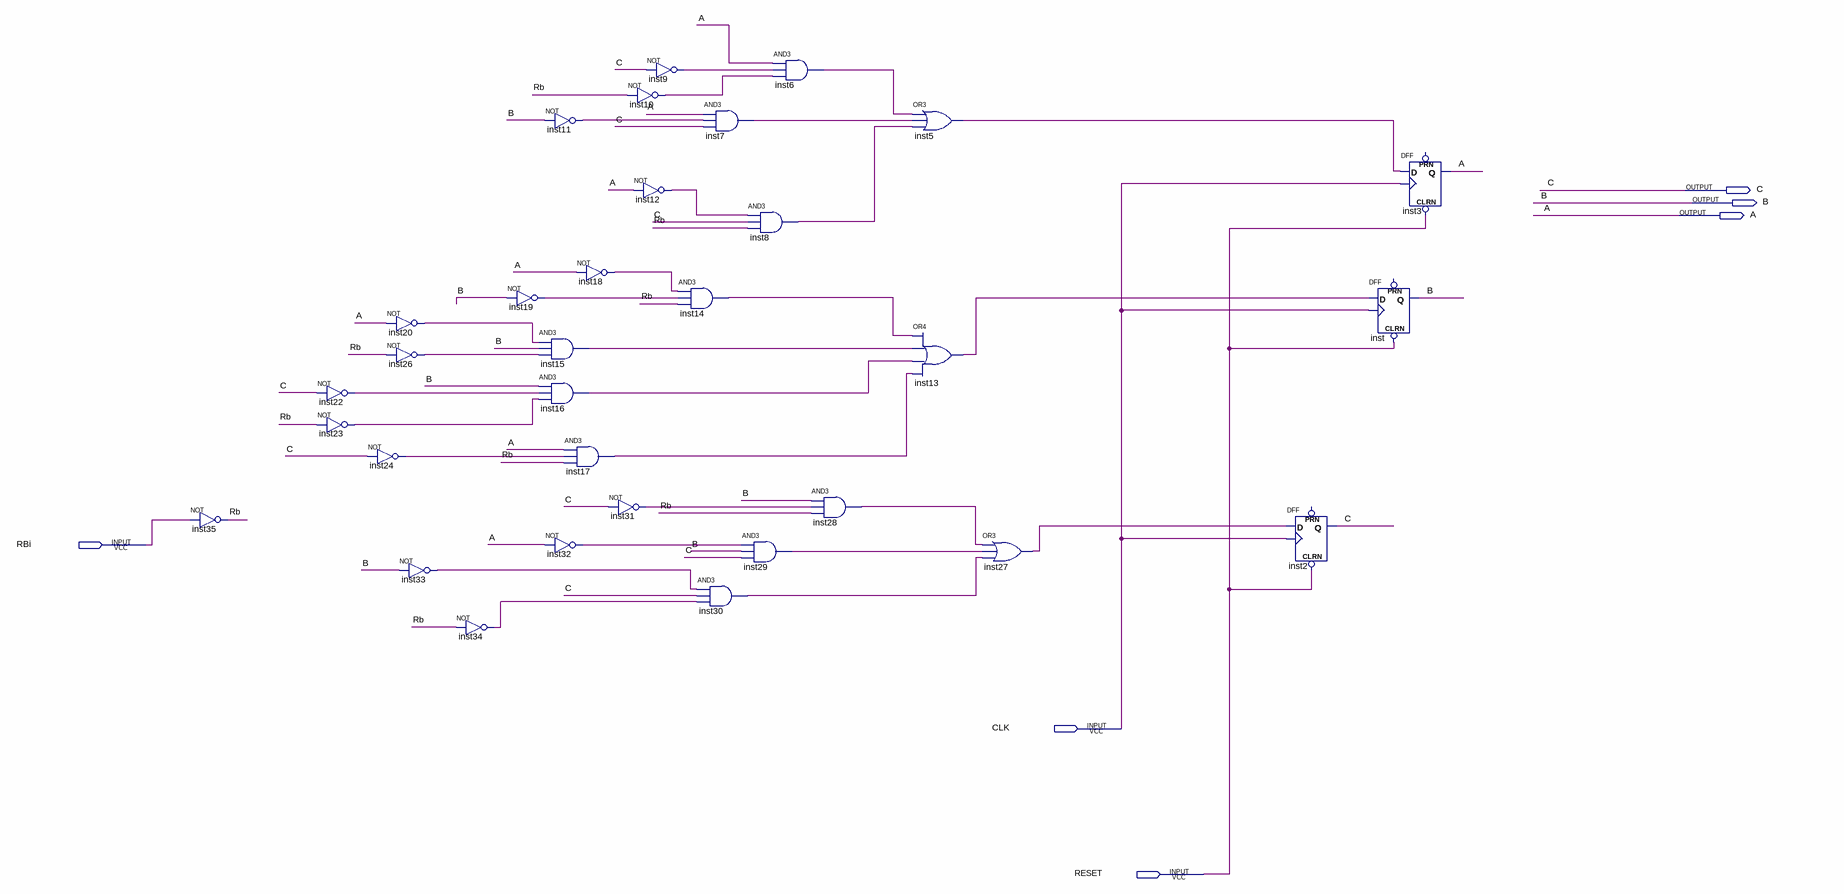
[diagram p0: schematic sheet]
// Quartus schematic Die.bdf as structural Verilog: 32 symbols, 6 pins
module Die (
  input  RBi,
  input  CLK,
  input  RESET,
  output C,
  output B,
  output A
);

  wire inst5_out, inst6_out, inst7_out, inst8_out, inst9_out, inst10_out, inst11_out, inst12_out, inst13_out,
       inst14_out, inst15_out, inst16_out, inst17_out, inst18_out, inst19_out, inst20_out, inst22_out,
       inst23_out, inst24_out, inst26_out, inst27_out, inst28_out, inst29_out, inst30_out, inst31_out,
       inst32_out, inst33_out, inst34_out, Rb;

  not inst35 (Rb, RBi);
  not inst22 (inst22_out, C);
  not inst23 (inst23_out, Rb);
  not inst24 (inst24_out, C);
  not inst20 (inst20_out, A);
  not inst26 (inst26_out, Rb);
  not inst33 (inst33_out, B);
  not inst34 (inst34_out, Rb);
  not inst19 (inst19_out, B);
  not inst11 (inst11_out, B);
  not inst18 (inst18_out, A);
  and inst15 (inst15_out, inst20_out, B, inst26_out);
  and inst16 (inst16_out, B, inst22_out, inst23_out);
  and inst17 (inst17_out, A, inst24_out, Rb);
  not inst32 (inst32_out, A);
  not inst10 (inst10_out, Rb);
  not inst31 (inst31_out, C);
  not inst9 (inst9_out, C);
  not inst12 (inst12_out, A);
  and inst14 (inst14_out, inst18_out, inst19_out, Rb);
  and inst7 (inst7_out, A, inst11_out, C);
  and inst30 (inst30_out, inst33_out, C, inst34_out);
  and inst6 (inst6_out, A, inst9_out, inst10_out);
  and inst8 (inst8_out, inst12_out, C, Rb);
  and inst29 (inst29_out, inst32_out, B, C);
  and inst28 (inst28_out, B, inst31_out, Rb);
  or inst5 (inst5_out, inst6_out, inst7_out, inst8_out);
  or inst13 (inst13_out, inst14_out, inst15_out, inst16_out, inst17_out);
  or inst27 (inst27_out, inst28_out, inst29_out, inst30_out);
  DFF inst2 (.CLRN(RESET), .CLK(CLK), .D(inst27_out), .Q(C));  // open: PRN
  DFF inst (.CLRN(RESET), .CLK(CLK), .D(inst13_out), .Q(B));  // open: PRN
  DFF inst3 (.CLRN(RESET), .CLK(CLK), .D(inst5_out), .Q(A));  // open: PRN
endmodule
